# Altium schematic sheet 0004_INDEX -3.SchDoc
size 848 x 558 mm
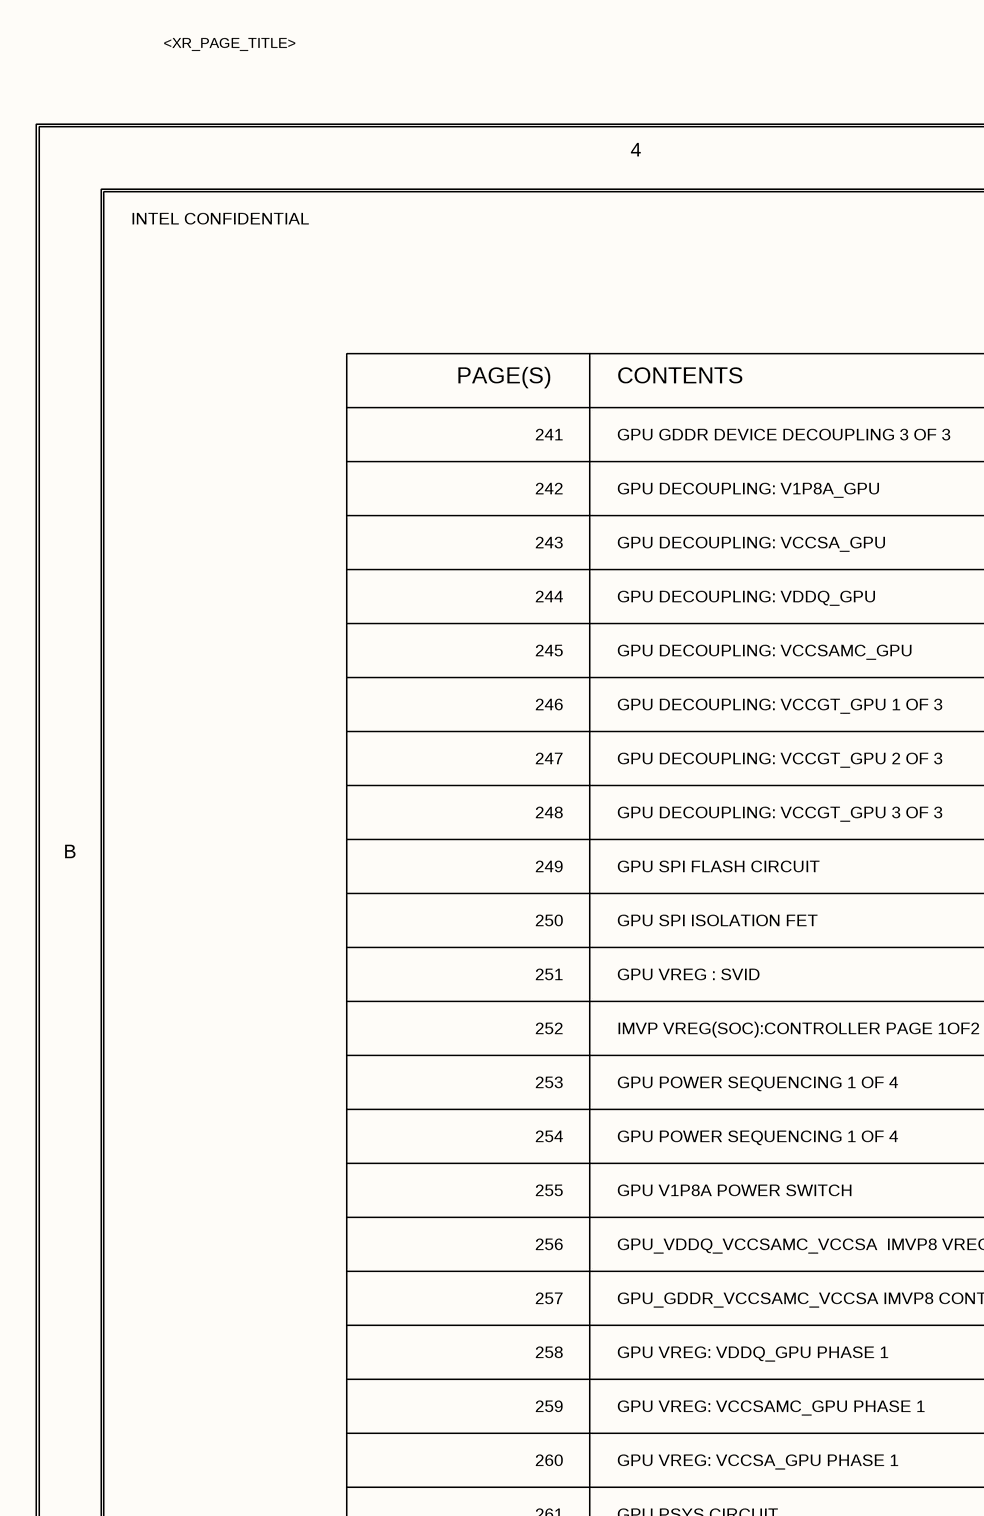
[diagram p0: 0004_INDEX -3.SchDoc, top left]
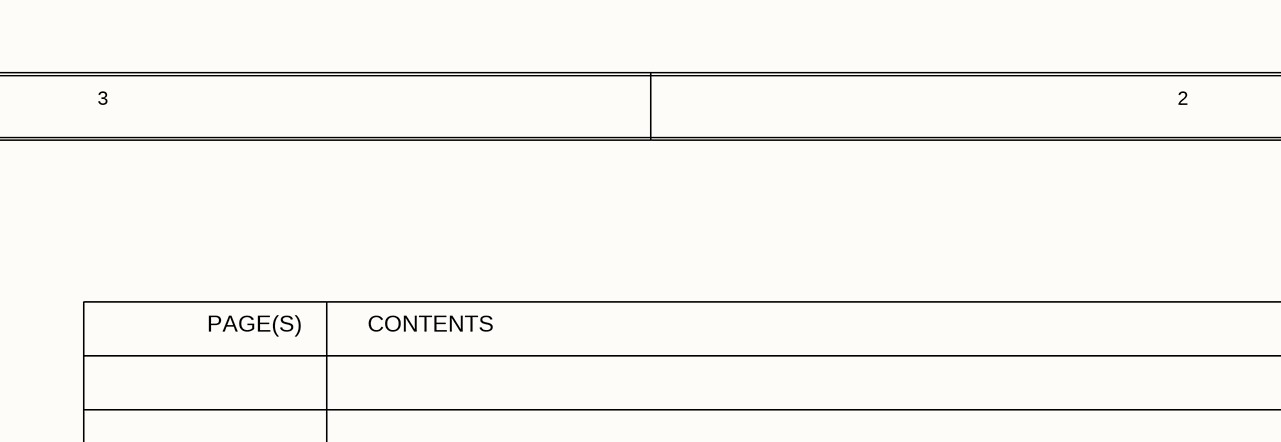
[diagram p1: 0004_INDEX -3.SchDoc, top middle]
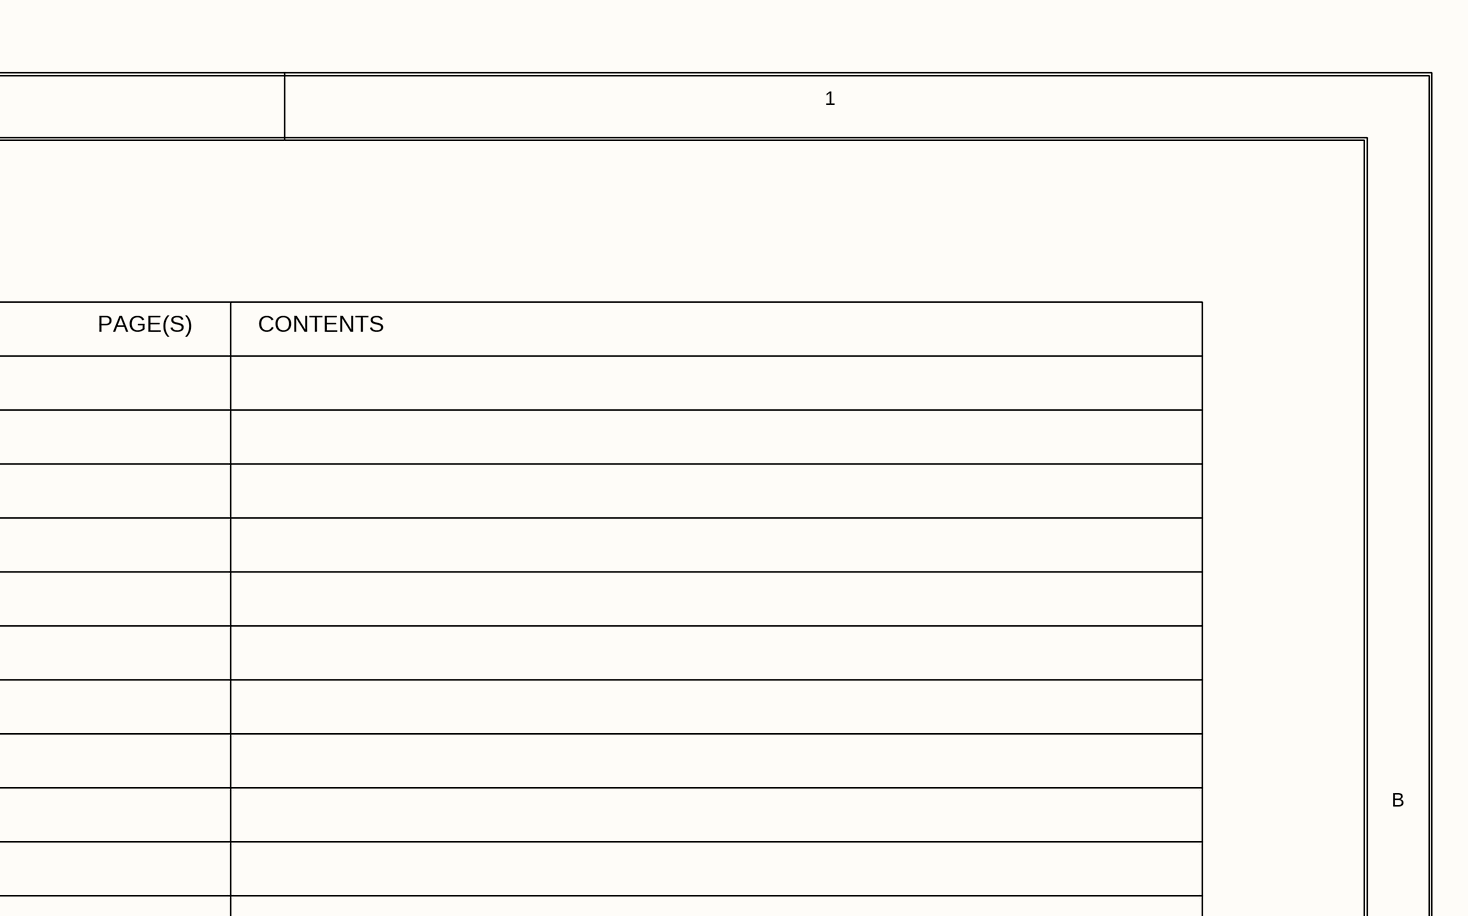
[diagram p2: 0004_INDEX -3.SchDoc, top right]
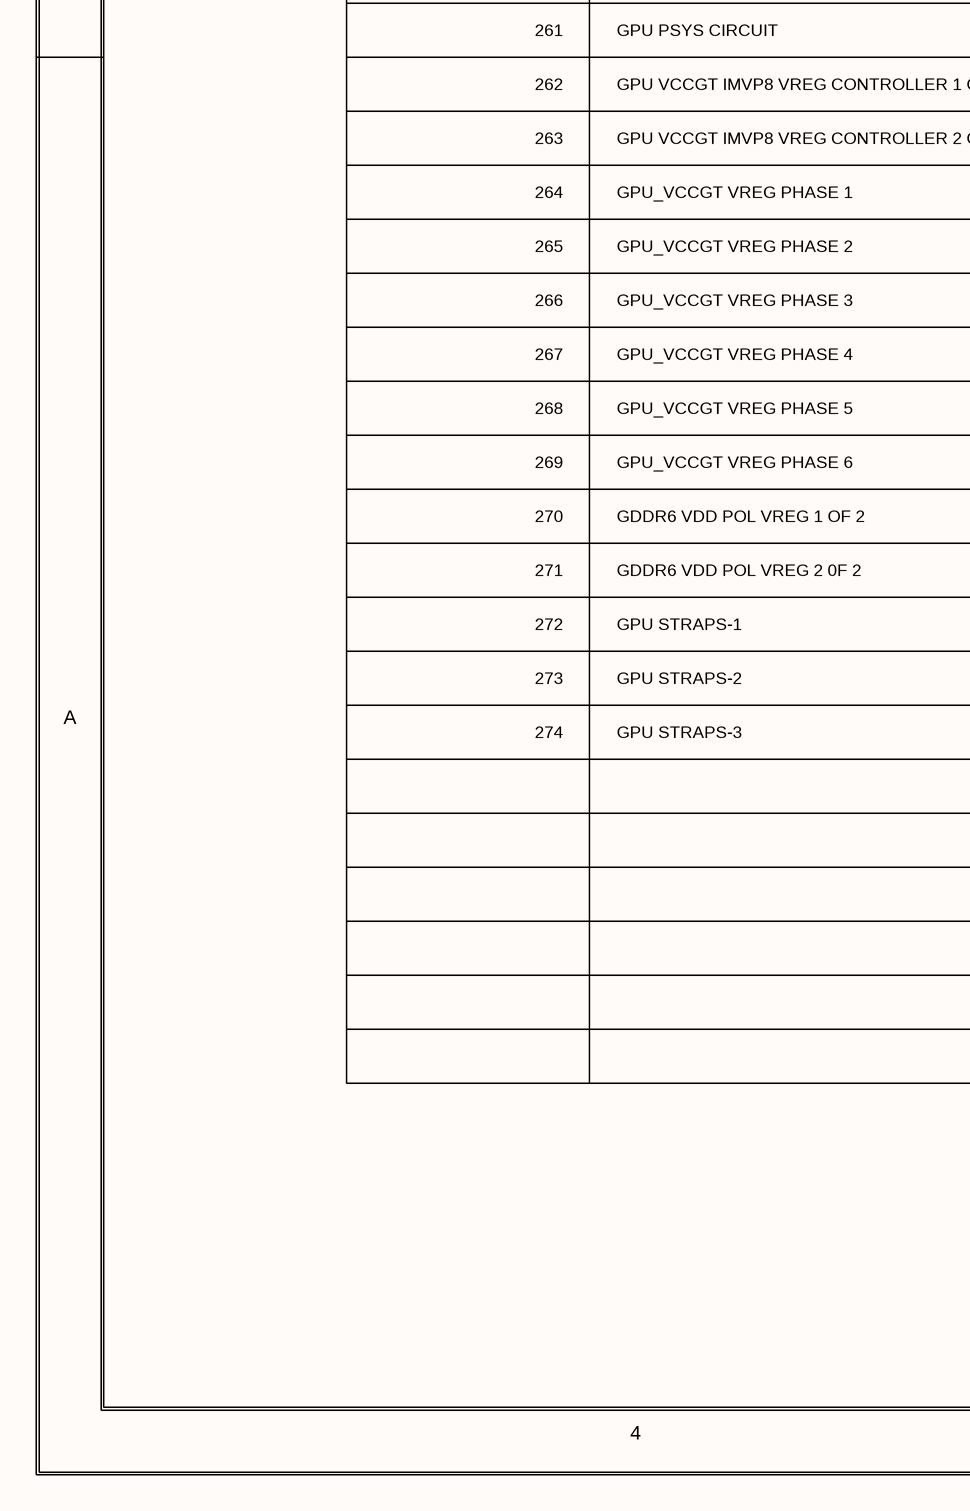
[diagram p3: 0004_INDEX -3.SchDoc, bottom left]
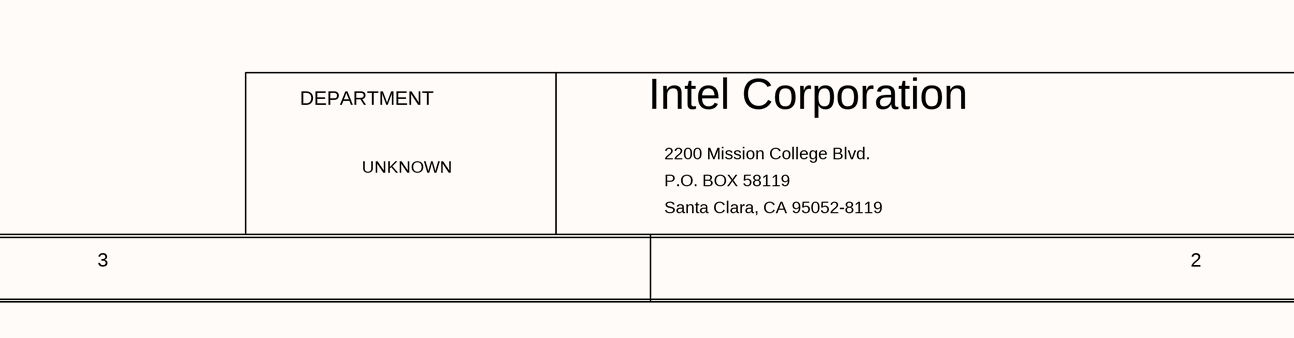
[diagram p4: 0004_INDEX -3.SchDoc, bottom middle]
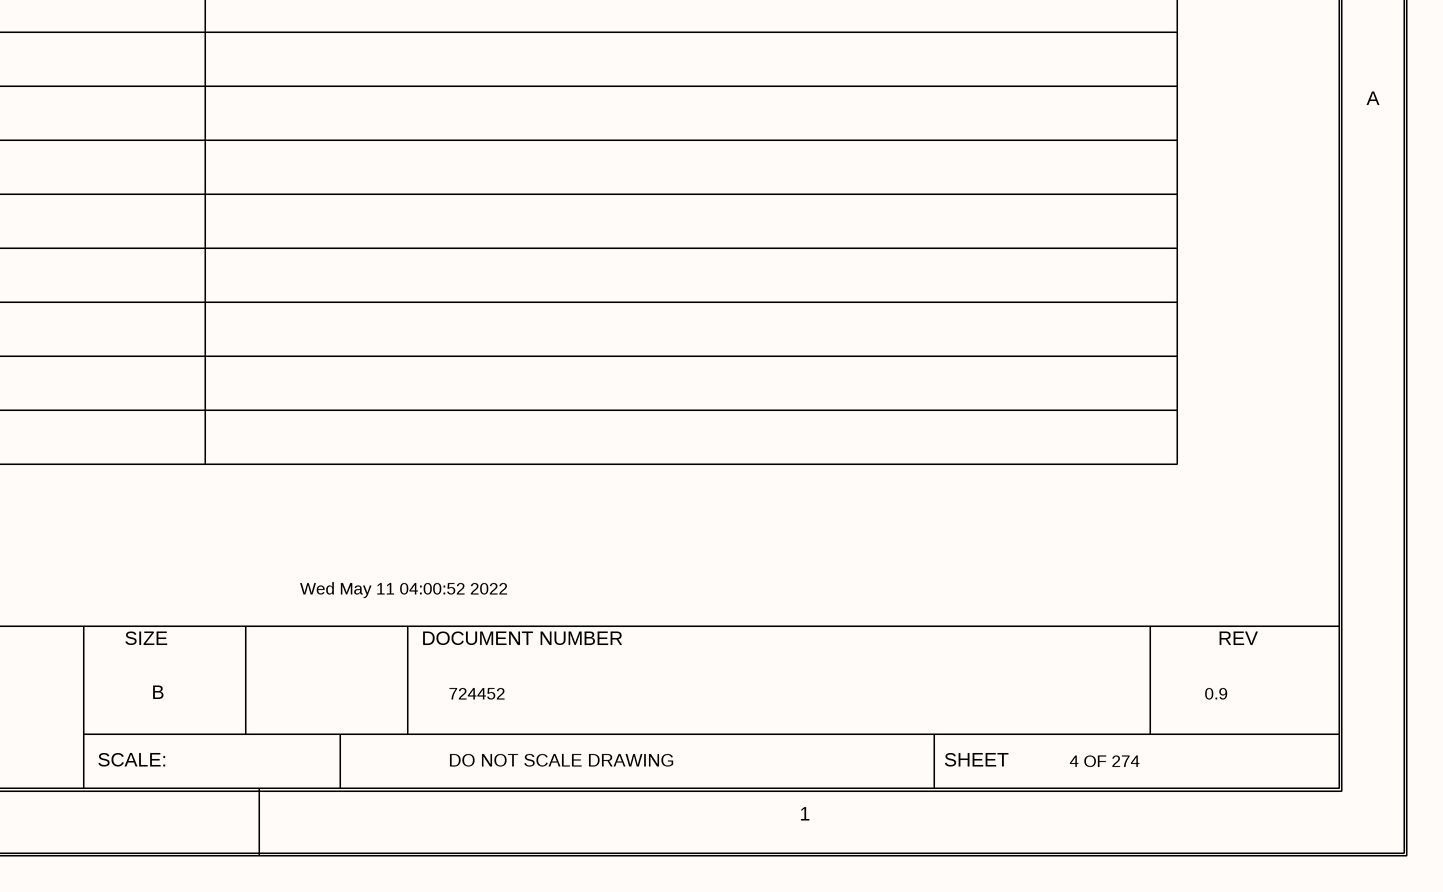
[diagram p5: 0004_INDEX -3.SchDoc, bottom right]

## Notes on the sheet
- <XR_PAGE_TITLE>
- 4
- 3
- 2
- 1
- INTEL CONFIDENTIAL
- PAGE(S)
- CONTENTS
- 241
- GPU GDDR DEVICE DECOUPLING 3 OF 3
- 242
- GPU DECOUPLING: V1P8A_GPU
- 243
- GPU DECOUPLING: VCCSA_GPU
- 244
- 245
- GPU DECOUPLING: VCCSAMC_GPU
- GPU DECOUPLING: VDDQ_GPU
- 246
- GPU DECOUPLING: VCCGT_GPU 1 OF 3
- 247
- GPU DECOUPLING: VCCGT_GPU 2 OF 3
- B
- 248
- GPU DECOUPLING: VCCGT_GPU 3 OF 3
- 249
- 250
- GPU SPI ISOLATION FET
- GPU SPI FLASH CIRCUIT
- 251
- GPU VREG : SVID
- 252
- IMVP VREG(SOC):CONTROLLER PAGE 1OF2
- 253
- GPU POWER SEQUENCING 1 OF 4
- 254
- 255
- GPU V1P8A POWER SWITCH
- 256
- GPU_VDDQ_VCCSAMC_VCCSA  IMVP8 VREG CONTROLLER
- 257
- GPU_GDDR_VCCSAMC_VCCSA IMVP8 CONTROLLER 2 OF 2
- 258
- GPU VREG: VDDQ_GPU PHASE 1
- 259
- 260
- GPU VREG: VCCSA_GPU PHASE 1
- GPU VREG: VCCSAMC_GPU PHASE 1
- 261
- GPU PSYS CIRCUIT
- 262
- GPU VCCGT IMVP8 VREG CONTROLLER 1 OF 2
- 263
- GPU VCCGT IMVP8 VREG CONTROLLER 2 OF 2
- 264
- 265
- GPU_VCCGT VREG PHASE 2
- GPU_VCCGT VREG PHASE 1
- 266
- GPU_VCCGT VREG PHASE 3
- 267
- GPU_VCCGT VREG PHASE 4
- 268
- GPU_VCCGT VREG PHASE 5
- 270
- 269
- GDDR6 VDD POL VREG 1 OF 2
- GPU_VCCGT VREG PHASE 6
- 271
- GDDR6 VDD POL VREG 2 0F 2
- 272
- GPU STRAPS-1
- A
- 273
- GPU STRAPS-2
- 274
- GPU STRAPS-3
- Wed May 11 04:00:52 2022
- SIZE
- DOCUMENT NUMBER
- REV
- DEPARTMENT
- Intel Corporation
- 2200 Mission College Blvd.
- 724452
- 0.9
- UNKNOWN
- Santa Clara, CA 95052-8119
- P.O. BOX 58119
- SCALE:
- DO NOT SCALE DRAWING
- SHEET
- 4 OF 274